# Altium schematic sheet EPS_Distribution.SchDoc: Distribution
size A3; SheetNumber: 47; SheetTotal: 51
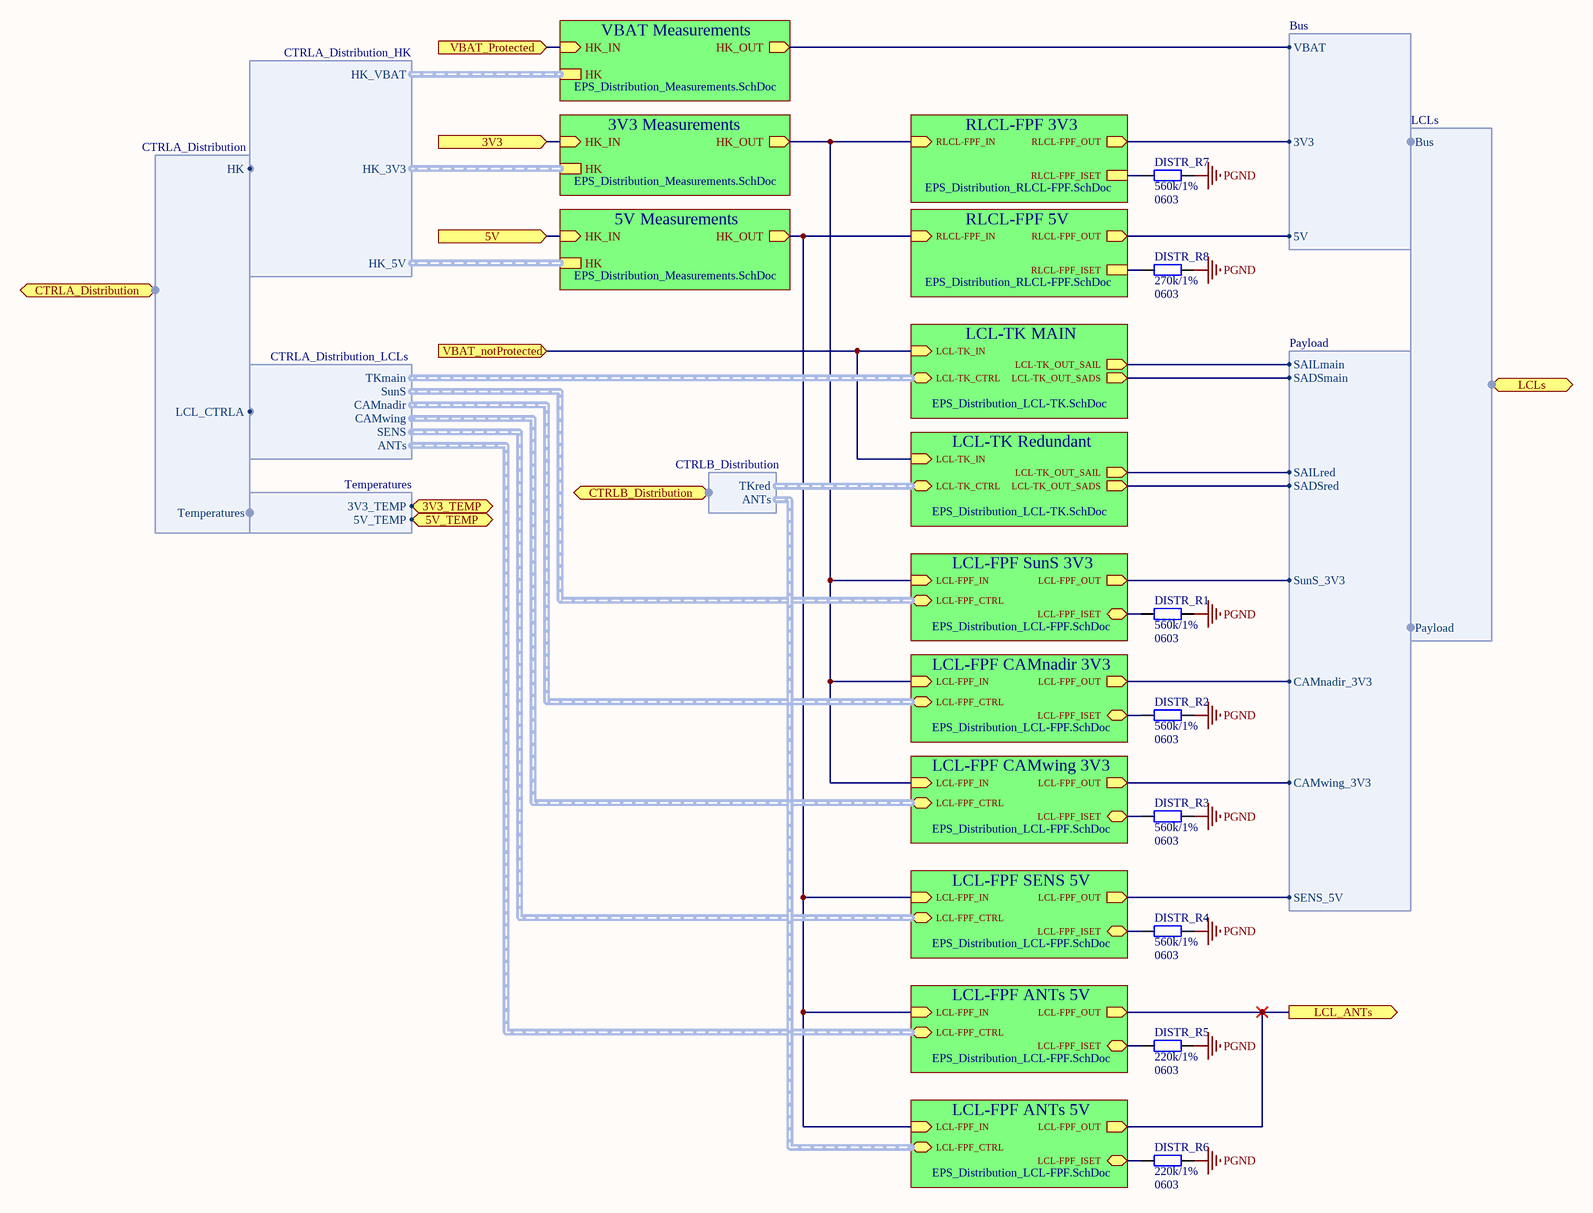
[diagram p0: EPS_Distribution.SchDoc]

## Parts
DISTR_R1  Package: 0603  [SMD_Resistor_0603]  (hidden comment: 560k/1%)
DISTR_R2  Package: 0603  [SMD_Resistor_0603]  (hidden comment: 560k/1%)
DISTR_R3  Package: 0603  [SMD_Resistor_0603]  (hidden comment: 560k/1%)
DISTR_R4  Package: 0603  [SMD_Resistor_0603]  (hidden comment: 560k/1%)
DISTR_R5  Package: 0603  [SMD_Resistor_0603]  (hidden comment: 220k/1%)
DISTR_R6  Package: 0603  [SMD_Resistor_0603]  (hidden comment: 220k/1%)
DISTR_R7  Package: 0603  [SMD_Resistor_0603]  (hidden comment: 560k/1%)
DISTR_R8  Package: 0603  [SMD_Resistor_0603]  (hidden comment: 270k/1%)

## Sub-sheets
3V3 Measurements = EPS_Distribution_Measurements.SchDoc: HK_IN (in), HK_OUT (out), HK (harness HK)
5V Measurements = EPS_Distribution_Measurements.SchDoc: HK_IN (in), HK_OUT (out), HK (harness HK)
LCL-FPF ANTs 5V = EPS_Distribution_LCL-FPF.SchDoc: LCL-FPF_OUT (out), LCL-FPF_ISET, LCL-FPF_IN (in), LCL-FPF_CTRL (harness LCL-FPF_CTRL)
LCL-FPF ANTs 5V = EPS_Distribution_LCL-FPF.SchDoc: LCL-FPF_OUT (out), LCL-FPF_ISET, LCL-FPF_IN (in), LCL-FPF_CTRL (harness LCL-FPF_CTRL)
LCL-FPF CAMnadir 3V3 = EPS_Distribution_LCL-FPF.SchDoc: LCL-FPF_OUT (out), LCL-FPF_ISET, LCL-FPF_IN (in), LCL-FPF_CTRL (harness LCL-FPF_CTRL)
LCL-FPF CAMwing 3V3 = EPS_Distribution_LCL-FPF.SchDoc: LCL-FPF_OUT (out), LCL-FPF_ISET, LCL-FPF_IN (in), LCL-FPF_CTRL (harness LCL-FPF_CTRL)
LCL-FPF SENS 5V = EPS_Distribution_LCL-FPF.SchDoc: LCL-FPF_OUT (out), LCL-FPF_ISET, LCL-FPF_IN (in), LCL-FPF_CTRL (harness LCL-FPF_CTRL)
LCL-FPF SunS 3V3 = EPS_Distribution_LCL-FPF.SchDoc: LCL-FPF_OUT (out), LCL-FPF_ISET, LCL-FPF_IN (in), LCL-FPF_CTRL (harness LCL-FPF_CTRL)
LCL-TK MAIN = EPS_Distribution_LCL-TK.SchDoc: LCL-TK_IN (in), LCL-TK_OUT_SADS (out), LCL-TK_CTRL (harness LCL-TK_CTRL), LCL-TK_OUT_SAIL (out)
LCL-TK Redundant = EPS_Distribution_LCL-TK.SchDoc: LCL-TK_IN (in), LCL-TK_OUT_SADS (out), LCL-TK_CTRL (harness LCL-TK_CTRL), LCL-TK_OUT_SAIL (out)
RLCL-FPF 3V3 = EPS_Distribution_RLCL-FPF.SchDoc: RLCL-FPF_IN (in), RLCL-FPF_OUT (out), RLCL-FPF_ISET
RLCL-FPF 5V = EPS_Distribution_RLCL-FPF.SchDoc: RLCL-FPF_IN (in), RLCL-FPF_OUT (out), RLCL-FPF_ISET
VBAT Measurements = EPS_Distribution_Measurements.SchDoc: HK_IN (in), HK_OUT (out), HK (harness HK)

## Ports
3V3 (in), 3V3_TEMP (in), 5V (in), 5V_TEMP (in), CTRLA_Distribution (harness CTRLA_Distribution), CTRLB_Distribution (harness CTRLB_Distribution), LCL_ANTs (out), LCLs (harness LCLs), VBAT_notProtected (in), VBAT_Protected (in)

## Harnesses
LCLs: Payload, Bus
Payload: SADSred, SAILred, SENS_5V, SAILmain, SADSmain, SunS_3V3, CAMnadir_3V3, CAMwing_3V3
CTRLB_Distribution: TKred, ANTs
Bus: 3V3, 5V, VBAT
CTRLA_Distribution_HK: HK_VBAT, HK_3V3, HK_5V
CTRLA_Distribution_LCLs: TKmain, SunS, CAMnadir, CAMwing, SENS, ANTs
CTRLA_Distribution: LCL_CTRLA, HK, Temperatures
Temperatures: 3V3_TEMP, 5V_TEMP

## Nets
PGND: DISTR_R1.1 DISTR_R2.1 DISTR_R3.1 DISTR_R4.1 DISTR_R5.1 DISTR_R6.1 DISTR_R7.1 DISTR_R8.1
3V3: port 3V3, sheet 3V3 Measurements/HK_IN
3V3_TEMP: port 3V3_TEMP, harness Temperatures.3V3_TEMP
5V: port 5V, sheet 5V Measurements/HK_IN
5V_TEMP: port 5V_TEMP, harness Temperatures.5V_TEMP
LCL_ANTs: port LCL_ANTs, sheet LCL-FPF ANTs 5V/LCL-FPF_OUT, sheet LCL-FPF ANTs 5V/LCL-FPF_OUT
VBAT_notProtected: port VBAT_notProtected, sheet LCL-TK MAIN/LCL-TK_IN, sheet LCL-TK Redundant/LCL-TK_IN
VBAT_Protected: port VBAT_Protected, sheet VBAT Measurements/HK_IN
NetDISTR_R1_2: DISTR_R1.2 ; sheet LCL-FPF SunS 3V3/LCL-FPF_ISET
NetDISTR_R2_2: DISTR_R2.2 ; sheet LCL-FPF CAMnadir 3V3/LCL-FPF_ISET
NetDISTR_R3_2: DISTR_R3.2 ; sheet LCL-FPF CAMwing 3V3/LCL-FPF_ISET
NetDISTR_R4_2: DISTR_R4.2 ; sheet LCL-FPF SENS 5V/LCL-FPF_ISET
NetDISTR_R5_2: DISTR_R5.2 ; sheet LCL-FPF ANTs 5V/LCL-FPF_ISET
NetDISTR_R6_2: DISTR_R6.2 ; sheet LCL-FPF ANTs 5V/LCL-FPF_ISET
NetDISTR_R7_2: DISTR_R7.2 ; sheet RLCL-FPF 3V3/RLCL-FPF_ISET
NetDISTR_R8_2: DISTR_R8.2 ; sheet RLCL-FPF 5V/RLCL-FPF_ISET
(unnamed): sheet LCL-FPF SunS 3V3/LCL-FPF_OUT, harness Payload.SunS_3V3
(unnamed): sheet LCL-FPF SunS 3V3/LCL-FPF_IN, sheet LCL-FPF CAMnadir 3V3/LCL-FPF_IN, sheet LCL-FPF CAMwing 3V3/LCL-FPF_IN, sheet 3V3 Measurements/HK_OUT, sheet RLCL-FPF 3V3/RLCL-FPF_IN
(unnamed): sheet LCL-FPF CAMnadir 3V3/LCL-FPF_OUT, harness Payload.CAMnadir_3V3
(unnamed): sheet LCL-FPF CAMwing 3V3/LCL-FPF_OUT, harness Payload.CAMwing_3V3
(unnamed): sheet LCL-TK MAIN/LCL-TK_OUT_SADS, harness Payload.SADSmain
(unnamed): sheet LCL-TK MAIN/LCL-TK_OUT_SAIL, harness Payload.SAILmain
(unnamed): sheet LCL-TK Redundant/LCL-TK_OUT_SADS, harness Payload.SADSred
(unnamed): sheet LCL-TK Redundant/LCL-TK_OUT_SAIL, harness Payload.SAILred
(unnamed): sheet LCL-FPF SENS 5V/LCL-FPF_OUT, harness Payload.SENS_5V
(unnamed): sheet LCL-FPF SENS 5V/LCL-FPF_IN, sheet RLCL-FPF 5V/RLCL-FPF_IN, sheet 5V Measurements/HK_OUT, sheet LCL-FPF ANTs 5V/LCL-FPF_IN, sheet LCL-FPF ANTs 5V/LCL-FPF_IN
(unnamed): sheet RLCL-FPF 5V/RLCL-FPF_OUT, harness Bus.5V
(unnamed): sheet VBAT Measurements/HK_OUT, harness Bus.VBAT
(unnamed): sheet RLCL-FPF 3V3/RLCL-FPF_OUT, harness Bus.3V3

## Notes on the sheet
- Title:
- Project:
- Author:
- Model:
- Document Number:
- Checked by:
- Rev:
- Date:
- Approved by:
- Sheet:
- of
- File name:

## Library data of the parts
DISTR_R1-DISTR_R8 = Res
  DISTR_R1-DISTR_R4 DISTR_R7: Value: 560k/1%
  DISTR_R5 DISTR_R6: Value: 220k/1%
  DISTR_R8: Value: 270k/1%